# EAGLE design vco-4069-schmitz (EAGLE 7.6.0)
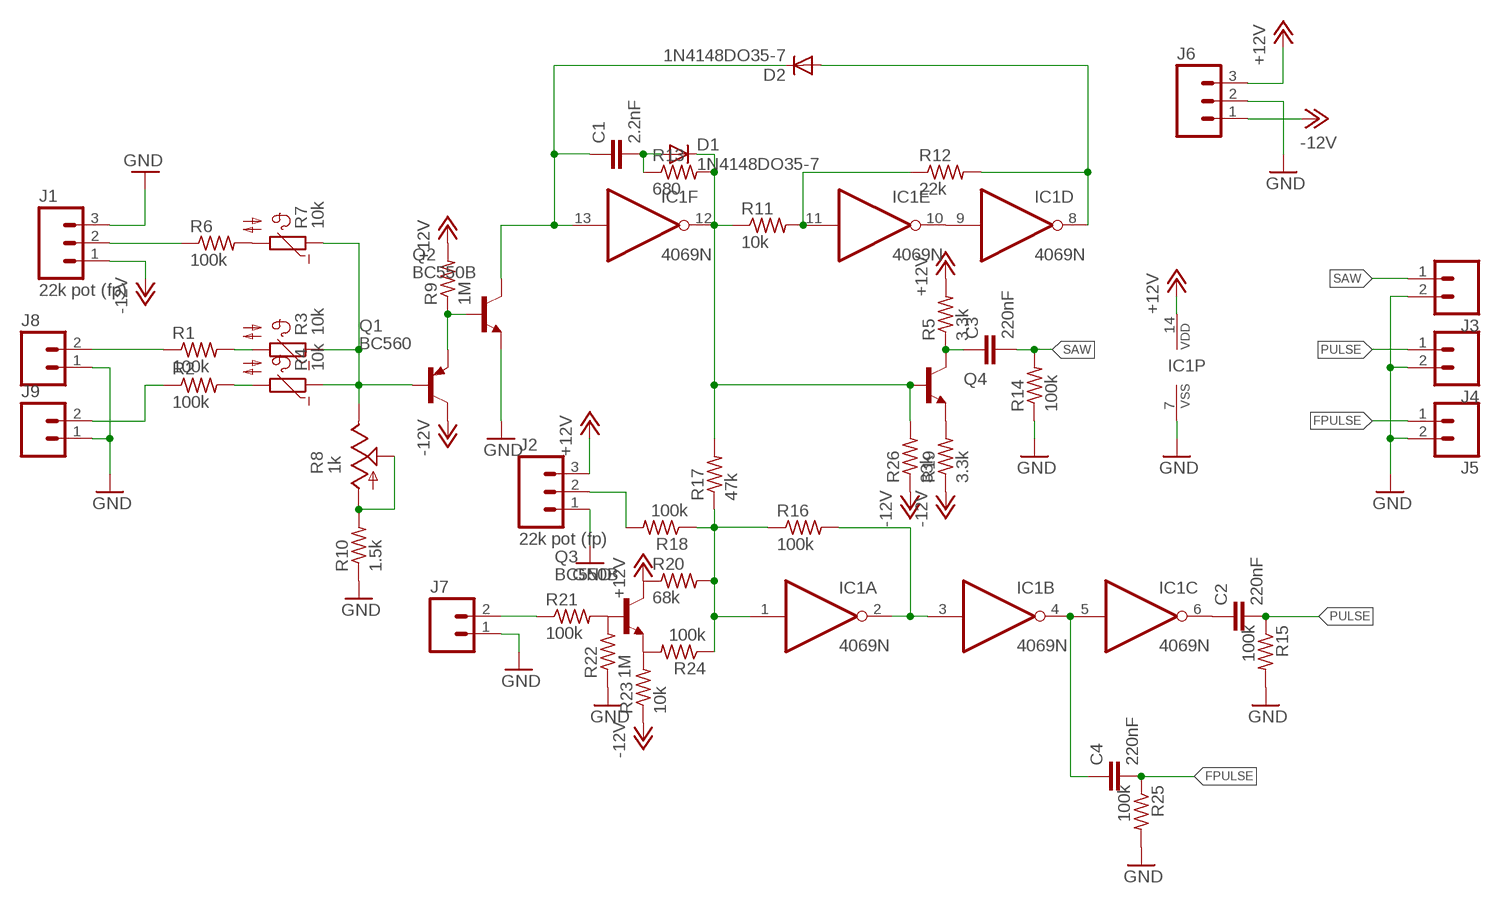
[diagram p0: schematic, sheet 1]

## Parts
C1  2.2nF  C-EU025-025X050  [C025-025X050]
C2  220nF  C-EU025-025X050  [C025-025X050]
C3  220nF  C-EU025-025X050  [C025-025X050]
C4  220nF  C-EU025-025X050  [C025-025X050]
D1  1N4148DO35-7  [DO35-7]
D2  1N4148DO35-7  [DO35-7]
IC1  4069N  [DIL14]
J1  22k pot (fp)  M03PTH  [1X03]
J2  22k pot (fp)  M03PTH  [1X03]
J3  M02PTH  [1X02]
J4  M02PTH  [1X02]
J5  M02PTH  [1X02]
J6  M03PTH  [1X03]
J7  M02PTH  [1X02]
J8  M02PTH  [1X02]
J9  M02PTH  [1X02]
Q1  BC560  [TO92-EBC]
Q2  BC550B  [TO92-EBC]
Q3  BC550B  [TO92-EBC]
Q4  TRANSISTOR_NPNBC547  [TO-92-AMMO]
R1  100k  R-US_0207/2V  [0207/2V]
R2  100k  R-US_0207/2V  [0207/2V]
R3  10k  NTC640-9  [N640]
R4  10k  NTC640-9  [N640]
R5  3.3k  R-US_0207/2V  [0207/2V]
R6  100k  R-US_0207/2V  [0207/2V]
R7  10k  NTC640-9  [N640]
R8  1k  TRIM_US-B25P  [B25P]
R9  1M  R-US_0207/2V  [0207/2V]
R10  1.5k  R-US_0207/2V  [0207/2V]
R11  10k  R-US_0207/2V  [0207/2V]
R12  22k  R-US_0207/2V  [0207/2V]
R13  680  R-US_0204/7  [0204/7]
R14  100k  R-US_0207/2V  [0207/2V]
R15  100k  R-US_0207/2V  [0207/2V]
R16  100k  R-US_0207/2V  [0207/2V]
R17  47k  R-US_0207/2V  [0207/2V]
R18  100k  R-US_0207/2V  [0207/2V]
R19  3.3k  R-US_0207/2V  [0207/2V]
R20  68k  R-US_0207/2V  [0207/2V]
R21  100k  R-US_0207/2V  [0207/2V]
R22  1M  R-US_0207/2V  [0207/2V]
R23  10k  R-US_0207/5V  [0207/5V]
R24  100k  R-US_0207/2V  [0207/2V]
R25  100k  R-US_0207/2V  [0207/2V]
R26  33k  R-US_0207/2V  [0207/2V]

## Nets
+12V: IC1.14(P:VDD) J2.3 J6.3 Q3.C R5.2 R9.2 R20.1
-12V: J1.1 J6.1 Q1.C R19.1 R23.1 R26.1
CV2: J9.2 R2.1
FPULSE: C4.2 J5.1 R25.1
GND: IC1.7(P:VSS) J1.3 J2.1 J3.2 J4.2 J5.2 J6.2 J7.1 J8.1 J9.1 Q2.E R10.1 R14.1 R15.2 R22.1 R25.2
N$1: J1.2 R6.1
N$2: R1.2 R3.2
N$3: R6.2 R7.2
N$4: R2.2 R4.2
N$5: Q3.E R23.2 R24.2
N$6: Q1.E Q2.B R9.1
N$7: R8.A R8.S R10.2
N$8: C1.1 D2.C IC1.13(F:I) Q2.C
N$9: IC1.2(A:O) IC1.3(B:I) R16.2
N$10: IC1.11(E:I) R11.2 R12.1
N$11: IC1.9(D:I) IC1.10(E:O)
N$12: D2.A IC1.8(D:O) R12.2
N$13: C1.2 D1.A R13.1
N$14: Q4.3(E) R19.2
N$15: C4.1 IC1.4(B:O) IC1.5(C:I)
N$16: C2.1 IC1.6(C:O)
N$17: IC1.1(A:I) R16.1 R17.1 R18.1 R20.2 R24.1
N$18: J2.2 R18.2
N$19: Q3.B R21.2 R22.2
N$20: Q1.B R3.1 R4.1 R7.1 R8.E
N$21: J7.2 R21.1
N$22: J8.2 R1.1
N$23: C3.1 Q4.1(C) R5.1
N$25: D1.C IC1.12(F:O) Q4.2(B) R11.1 R13.2 R17.2 R26.2
PULSE: C2.2 J4.1 R15.1
SAW: C3.2 J3.1 R14.2

## Library data of the parts
C1-C4 = resistor:C-EU: CAPACITOR, European symbol
D1 D2 = diode:1N4148: DIODE high speed (Philips)
IC1 = 40xx:4069: Hex INVERTER
J1 J2 J6 = SparkFun-Connectors:M03: Header 3 Standard 3-pin 0.1" header. Use with straight break away headers (SKU : PRT-00116), right angle break away headers (PRT-00553), swiss pins (PRT-00743), machine pins (PRT-00117), and female headers (PRT-00115). Molex polarized connector foot print use with SKU : PRT-08232 with associated crimp pins and housings.
J3-J5 J7-J9 = SparkFun-Connectors:M02: Standard 2-pin 0.1" header. Use with - straight break away headers ( PRT-00116) - right angle break away headers (PRT-00553) - swiss pins (PRT-00743) - machine pins (PRT-00117) - female headers (PRT-00115) Molex polarized connector foot print use with: PRT-08233 with associated crimp pins and housings. 2.54_SCREWTERM for use with PRT-10571. 3.5mm Screw Terminal footprints for PRT-08084 5mm Screw Terminal footprints for use with PRT-08432
Q1 = transistor-pnp:BC560*: PNP Transistror
Q2 Q3 = transistor-npn:BC550*: NPN Transistor
Q4 = SparkFun-DiscreteSemi:TRANSISTOR_NPN: Generic NPN BJT MMBT2222A - TRANS-08049 (SOT-23, 1A 40V) MPSA42 - TRANS-09116 (SOT-23, 500mA 300V) MMBT5088LT1G - TRANS-11160 (SOT-23, 50 mA 30V) BC547 - COM-08928 <http://www.sparkfun.com/products/8928> (TO-92 45V 100mA) (1.Collector 2.Base 3.Emitter) 2N3904 - COM-00521 <http://www.sparkfun.com/products/521> (TO-92 40V 200mA) (1.Emitter 2.Base 3.Collector) P2N2222A - COM-12852 <http://www.sparkfun.com/products/12852> (TO-92 40V 600mA) (1.Collector 2.Base 3.Emitter)
R1 R2 R5 R6 R9-R26 = resistor:R-US_: RESISTOR, American symbol
R3 R4 R7 = ptc-ntc:NTC640-9: PHILIPS NTC; OC_FARNELL: unknown; OC_NEWARK: unknown
R8 = pot:TRIM_US-: POTENTIOMETER

## Board
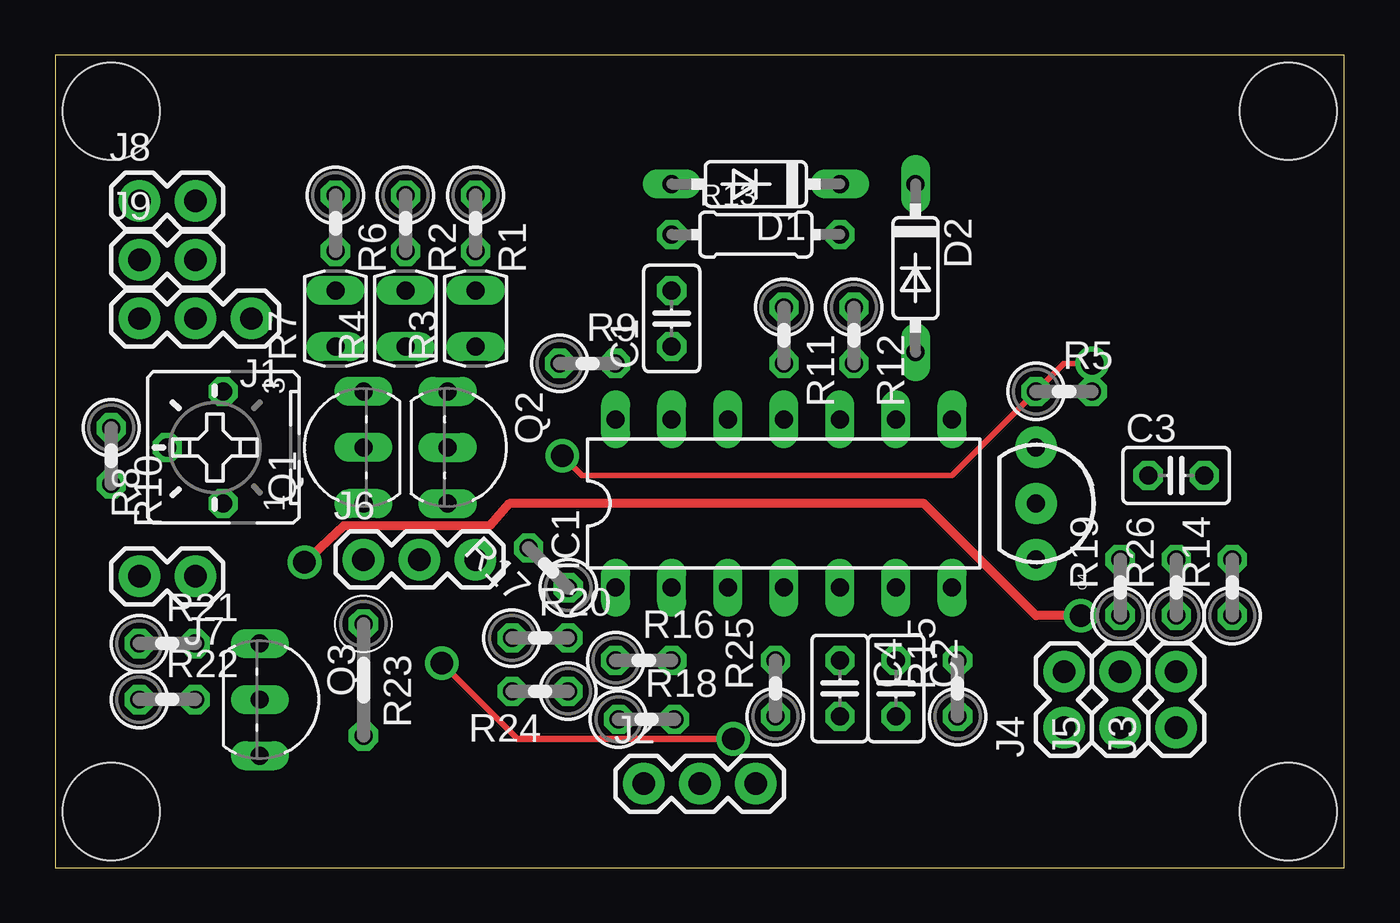
[diagram p1: board, top side]
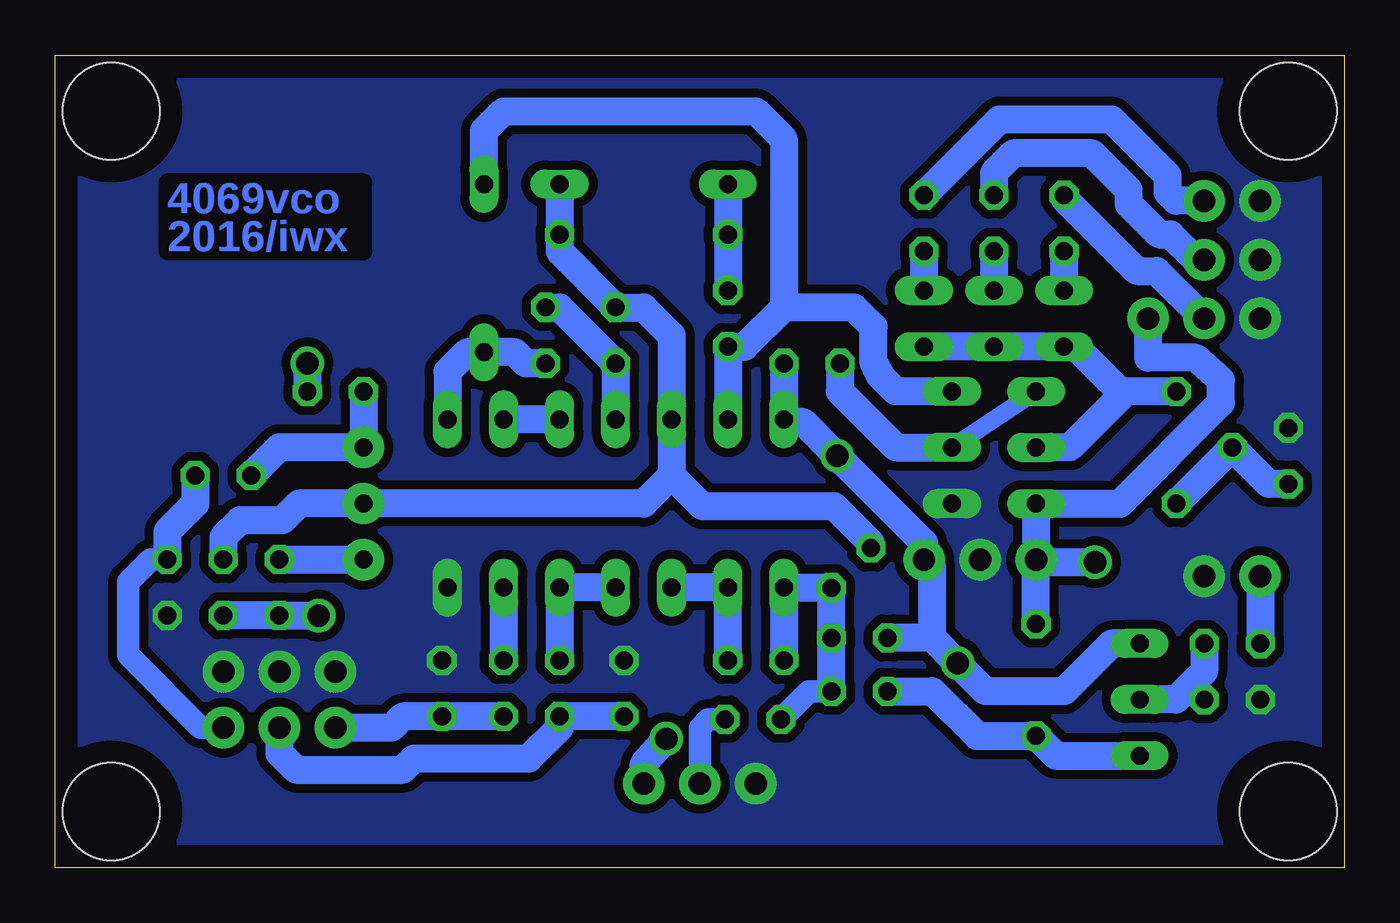
[diagram p2: board, bottom side, seen from below]

Size 58.42 x 36.83 mm. Coordinates in mm from the lower left corner, seen from the top.
Outline: 0,0 58.42,0 58.42,36.83 0,36.82 0,0
Copper layers (1*16): Top 0.035mm / dielectric 1.5mm / Bottom 0.035mm
Design rules "default": minimum track width 10mil, minimum drill 24mil, track to track 8mil, track to pad 8mil, pad to pad 8mil, via to via 8mil, smd to smd 8mil, copper to edge 40mil, drill to drill 8mil, minimum pad ring 10mil, minimum via ring 8mil, stop-mask expansion 4mil, vias tented up to drill 0mil, thermal gap 10mil
Holes 4.4 mm at 2.54,2.54 2.54,34.29 55.88,34.29 55.88,2.54

### Footprints (pad centres in the part's own frame; a part is rotated, then mirrored left to right if it is on the bottom)
C025-025X050 = drill 0.813 octagon: 1 -1.27,0; 2 1.27,0
DO35-7 = drill 0.813 long: A 3.81,0; C -3.81,0
DIL14 = drill 0.813 long: 1 -7.62,-3.81; 2 -5.08,-3.81; 3 -2.54,-3.81; 4 0,-3.81; 5 2.54,-3.81; 6 5.08,-3.81; 7 7.62,-3.81; 8 7.62,3.81; 9 5.08,3.81; 10 2.54,3.81; 11 0,3.81; 12 -2.54,3.81; 13 -5.08,3.81; 14 -7.62,3.81
1X03 = drill 1.016 pad 1.88: 1 0,0; 2 2.54,0; 3 5.08,0
1X02 = drill 1.016 pad 1.88: 1 0,0; 2 2.54,0
TO92-EBC = drill 0.813 long: B 0,-1.27; C -2.54,-1.27; E 2.54,-1.27
TO-92-AMMO = drill 0.813 pad 1.88: 1 -2.54,0; 2 0,0; 3 2.54,0
0207/2V = drill 0.813 octagon: 1 -1.27,0; 2 1.27,0
N640 = drill 0.813 long: 1 -1.27,0; 2 1.27,0
B25P = drill 0.813 octagon: A -2.54,0; E 2.54,0; S 0,2.54
0204/7 = drill 0.813 octagon: 1 -3.81,0; 2 3.81,0
0207/5V = drill 0.813 octagon: 1 -2.54,0; 2 2.54,0

### Placement (x,y rotation side)
C1  27.94,24.89 90 top
C2  38.1,8.13 270 top
C3  50.8,17.78 0 top
C4  35.56,8.13 270 top
D1  31.75,30.99 180 top
D2  38.99,27.18 270 top
IC1  33.02,16.51 0 top
J1  8.89,24.89 180 top
J2  26.67,3.81 0 top
J3  50.8,6.35 90 top
J4  45.72,6.35 90 top
J5  48.26,6.35 90 top
J6  13.97,13.97 0 top
J7  6.35,13.21 180 top
J8  3.81,30.23 0 top
J9  3.81,27.56 0 top
Q1  12.7,19.05 90 top
Q2  19.05,19.05 270 top
Q3  10.54,7.62 270 top
Q4  44.45,16.51 270 top
R1  19.05,29.21 270 top
R2  15.88,29.21 270 top
R3  19.05,24.89 90 top
R4  15.88,24.89 90 top
R5  45.72,21.59 0 top
R6  12.7,29.21 270 top
R7  12.7,24.89 90 top
R8  7.62,19.05 90 top
R9  24.13,22.86 0 top
R10  2.54,18.67 270 top
R11  33.02,24.13 270 top
R12  36.2,24.13 270 top
R13  31.75,28.7 0 top
R14  53.34,12.7 90 top
R15  40.89,8.13 90 top
R16  26.67,9.4 0 top
R17  22.35,13.59 135 top
R18  26.8,6.73 0 top
R19  48.26,12.7 90 top
R20  21.97,10.41 0 top
R21  5.08,10.16 0 top
R22  5.08,7.62 0 top
R23  13.97,8.51 270 top
R24  21.97,8 180 top
R25  32.64,8.13 90 top
R26  50.8,12.7 90 top

### Tracks (layer width: path | path; a pad name or v marks a point on that pad's centre or on a via)
+12V  (via drill 1.02)
  Top 0.254: v46.99,22.86 45.72,22.86 40.64,17.78 23.88,17.78 v22.99,18.67
  Top 0.305: v30.73,5.84 20.95,5.84 v17.53,9.27
  Bottom 1.27: R9.2 IC1.14 25.27,20.19 24.51,20.19 v22.99,18.67 19.05,14.73 J6.3 18.67,13.59 18.67,10.41 | Q3.C 10.54,10.16 12.7,8 16.26,8 v17.53,9.27 18.67,10.41 | 18.67,10.41 R20.1 | J2.3 31.75,4.7 v30.73,5.84 | R5.2 v46.99,22.86
-12V  (via drill 1.02)
  Top 0.406: v46.48,11.43 44.45,11.43 39.37,16.51 20.57,16.51 19.68,15.49 13.08,15.49 v11.3,13.84
  Bottom 1.27: R26.1 R19.1 v46.48,11.43 | J6.1 Q1.C 10.16,16.51 5.59,21.08 5.59,22.1 6.73,23.11 8.89,23.11 J1.1 | R23.1 J6.1 | v11.3,13.84 13.84,13.84 J6.1
CV2
  Bottom 1.27: J9.2 6.73,27.56 7.87,28.7 8.38,28.7 9.78,30.1 9.78,30.73 11.43,32.38 14.99,32.38 15.88,31.5 R2.1
FPULSE
  Bottom 1.27: R25.1 C4.2 35.56,6.35 36.96,4.95 42.16,4.95 42.67,4.45 47.5,4.45 48.26,5.21 J5.1
GND
  pour Bottom (isolate 0.406, no thermals): -5.08,40.64 63.5,40.64 63.5,-5.08 -5.08,-5.08
N$1
  Bottom 1.27: R6.1 12.7,30.35 9.4,27.05 8.51,27.05 J1.2
N$2
  Bottom 1.27: R1.2 R3.2
N$3
  Bottom 1.27: R6.2 R7.2
N$4
  Bottom 1.27: R2.2 R4.2
N$5
  Bottom 1.27: Q3.E 13.08,5.08 R23.2 16.64,5.97 18.67,8 R24.2
N$6
  Bottom 0.813: Q1.E Q2.B
  Bottom 1.27: R9.1 22.86,21.59 20.32,19.05 Q2.B
N$7
  Bottom 1.27: R10.2 3.43,17.4 R8.S R8.A
N$8
  Bottom 1.27: IC1.13 C1.1 27.18,23.62 25.4,25.4 | D2.C 38.99,33.4 38.1,34.29 26.67,34.29 25.4,33.02 25.4,25.4 | Q2.C 20.32,21.59 21.08,22.35 21.08,22.48 21.21,22.61 21.21,22.73 21.34,22.86 21.34,24.51 22.23,25.4 25.4,25.4
N$9
  Bottom 1.27: IC1.3 IC1.2 R16.2
N$10
  Bottom 1.27: IC1.11 R11.2 35.56,25.4 R12.1
N$11
  Bottom 1.27: IC1.10 IC1.9
N$12
  Bottom 1.27: R12.2 37.08,22.86 37.59,23.37 D2.A 39.75,23.37 40.64,22.48 IC1.8
N$13
  Bottom 1.27: D1.A R13.1 C1.2
N$14
  Bottom 1.27: R19.2 Q4.3
N$15
  Bottom 1.27: IC1.4 IC1.5 C4.1
N$16
  Bottom 1.27: IC1.6 C2.1
N$17
  Bottom 1.016: R24.1 24.26,8 R18.1
  Bottom 1.27: R16.1 IC1.1 R17.1 R20.2 R24.1
N$18
  Bottom 1.016: R18.2 28.83,6.73 29.21,6.35 J2.2
N$19
  Bottom 1.27: R21.2 6.35,8.89 6.99,8.26 | 6.99,8.26 7.62,7.62 Q3.B | R22.2 6.99,8.26
N$20
  Bottom 1.27: R8.E 10.16,21.59 | 10.16,21.59 10.16,21.34 12.45,19.05 Q1.B | 10.16,21.59 12.19,23.62 R7.1 R4.1 R3.1
N$21
  Bottom 1.27: J7.2 R21.1
N$22
  Bottom 1.27: J8.2 7.62,30.23 8,30.61 8,31.37 10.54,33.91 15.62,33.91 R1.1
N$23
  Bottom 1.27: C3.1 48.26,19.05 Q4.1 R5.1
N$25
  Bottom 1.27: D1.C R13.2 35.56,27.94 R11.1 31.75,25.4 30.48,24.13 IC1.12 30.48,17.78 | 30.48,17.78 31.75,16.51 Q4.2 47.37,16.51 48.13,15.75 50.04,15.75 50.8,14.99 R26.2 | R17.2 21.45,14.72 23.11,16.38 29.08,16.38 30.48,17.78
PULSE
  Bottom 1.27: C2.2 R15.1 42.67,6.86 43.18,6.35 J4.1
SAW
  Bottom 1.016: R14.2 54.1,13.97 55.12,12.95 55.12,9.65 51.82,6.35 J3.1
  Bottom 1.27: C3.2 52.07,16.51 53.34,15.24 R14.2

### Text on the board
Bottom: 4069vco / 2016/iwx